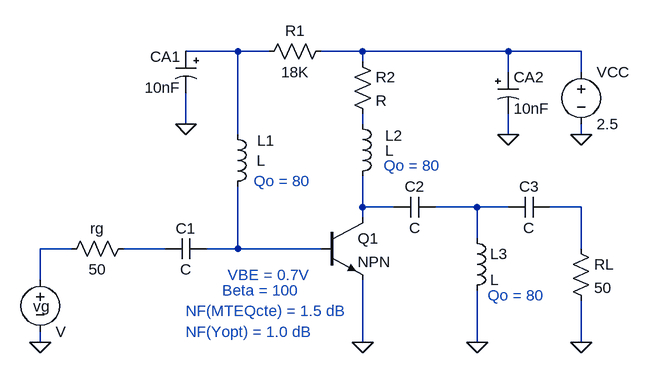
[diagram p0: schematic circuitos.asc]
circuitos.asc, the LTspice schematic file:
Version 4
SHEET 1 880 680
WIRE 96 16 16 16
WIRE 144 16 96 16
WIRE 288 16 224 16
WIRE 512 16 288 16
WIRE 624 16 512 16
WIRE 288 32 288 16
WIRE 512 48 512 16
WIRE 624 48 624 16
WIRE 16 128 16 80
WIRE 288 128 288 112
WIRE 96 144 96 16
WIRE 512 144 512 112
WIRE 624 144 624 128
WIRE 288 256 288 208
WIRE 336 256 288 256
WIRE 464 256 400 256
WIRE 512 256 464 256
WIRE 624 256 576 256
WIRE 288 272 288 256
WIRE 464 304 464 256
WIRE -160 320 -208 320
WIRE -16 320 -80 320
WIRE 96 320 96 224
WIRE 96 320 48 320
WIRE 224 320 96 320
WIRE 624 320 624 256
WIRE -208 368 -208 320
WIRE -208 464 -208 448
WIRE 288 464 288 368
WIRE 464 464 464 384
WIRE 624 464 624 400
FLAG 624 144 0
FLAG 512 144 0
FLAG 16 128 0
FLAG 288 464 0
FLAG 464 464 0
FLAG -208 464 0
FLAG 624 464 0
SYMBOL ind 80 128 R0
WINDOW 0 46 25 Left 2
WINDOW 3 45 56 Left 2
SYMATTR InstName L1
SYMBOL ind 272 112 R0
WINDOW 0 51 34 Left 2
WINDOW 3 51 57 Left 2
SYMATTR InstName L2
SYMBOL res 272 16 R0
SYMATTR InstName R2
SYMBOL res 240 0 R90
WINDOW 0 0 56 VBottom 2
WINDOW 3 32 56 VTop 2
SYMATTR InstName R1
SYMATTR Value 18K
SYMBOL polcap 32 16 M0
SYMATTR InstName CA1
SYMATTR Value 10nF
SYMATTR Description Capacitor
SYMATTR Type cap
SYMATTR SpiceLine V=12.5 Irms=3.53553 Rser=0.02 Lser=0 mfg="KEMET" pn="A700D476M12RATE020" type="Al electrolytic"
SYMBOL voltage 624 32 R0
SYMATTR InstName VCC
SYMATTR Value 2.5
SYMBOL npn 224 272 R0
SYMATTR InstName Q1
SYMBOL cap 400 240 R90
WINDOW 0 0 32 VBottom 2
WINDOW 3 32 32 VTop 2
SYMATTR InstName C2
SYMBOL cap 48 304 R90
WINDOW 0 0 32 VBottom 2
WINDOW 3 32 32 VTop 2
SYMATTR InstName C1
SYMBOL voltage -208 352 R0
WINDOW 0 -11 57 Left 2
SYMATTR InstName vg
SYMBOL res -64 304 R90
WINDOW 0 0 56 VBottom 2
WINDOW 3 32 56 VTop 2
SYMATTR InstName rg
SYMATTR Value 50
SYMBOL res 608 304 R0
SYMATTR InstName RL
SYMATTR Value 50
SYMBOL ind 448 288 R0
SYMATTR InstName L3
SYMBOL cap 576 240 R90
WINDOW 0 0 32 VBottom 2
WINDOW 3 32 32 VTop 2
SYMATTR InstName C3
SYMBOL polcap 496 48 R0
WINDOW 3 24 56 Left 2
SYMATTR InstName CA2
SYMATTR Value 10nF
SYMATTR Description Capacitor
SYMATTR Type cap
SYMATTR SpiceLine V=12.5 Irms=3.53553 Rser=0.02 Lser=0 mfg="KEMET" pn="A700D476M12RATE020" type="Al electrolytic"
TEXT 80 360 Left 2 ;VBE = 0.7V
TEXT 72 384 Left 2 ;Beta = 100
TEXT 120 216 Left 2 ;Qo = 80
TEXT 320 192 Left 2 ;Qo = 80
TEXT 480 392 Left 2 ;Qo = 80
TEXT 16 416 Left 2 ;NF(MTEQcte) = 1.5 dB
TEXT 16 448 Left 2 ;NF(Yopt) = 1.0 dB

The netlist it stands for:
* circuitos.asc
L1 N001 N009 L
L2 N003 N004 L
R2 N002 N003 R
R1 N002 N001 18K
CA1 N001 0 10nF V=12.5 Irms=3.53553 Rser=0.02 Lser=0 mfg="KEMET" pn="A700D476M12RATE020" type="Al electrolytic"
VCC N002 0 2.5
Q1 N004 N009 0 0 NPN
C2 N005 N004 C
C1 N009 N008 C
vg N007 0 V
rg N008 N007 50
RL N006 0 50
L3 N005 0 L
C3 N006 N005 C
CA2 N002 0 10nF V=12.5 Irms=3.53553 Rser=0.02 Lser=0 mfg="KEMET" pn="A700D476M12RATE020" type="Al electrolytic"
.model NPN NPN
.model PNP PNP
.lib standard.bjt
* VBE = 0.7V
* Beta = 100
* Qo = 80
* Qo = 80
* Qo = 80
* NF(MTEQcte) = 1.5 dB
* NF(Yopt) = 1.0 dB
.backanno
.end